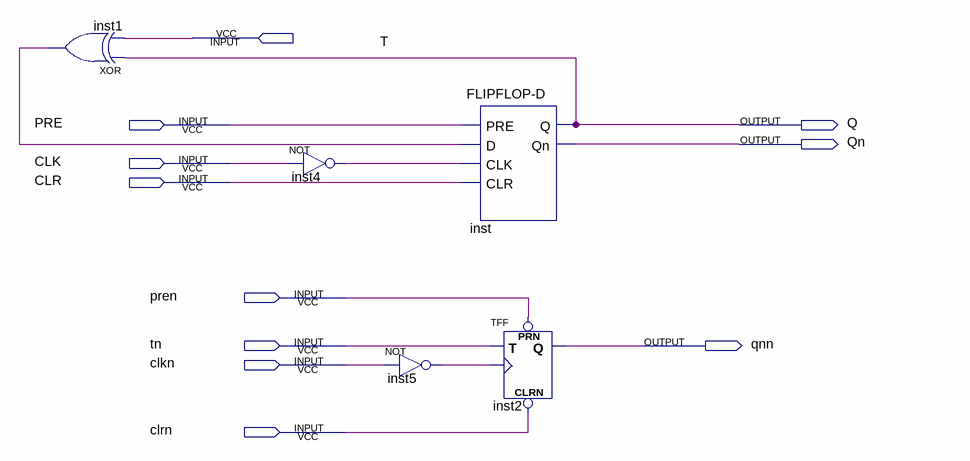
[diagram p0: schematic sheet]
// Quartus schematic FLIPFLOP-T.bdf as structural Verilog: 5 symbols, 11 pins
module \FLIPFLOP-T  (
  input  T,
  input  PRE,
  input  CLK,
  input  CLR,
  input  pren,
  input  tn,
  input  clkn,
  input  clrn,
  output Q,
  output Qn,
  output qnn
);

  wire inst1_out, inst4_out, inst5_out;

  xor inst1 (inst1_out, Q, T);
  not inst4 (inst4_out, CLK);
  not inst5 (inst5_out, clkn);
  \FLIPFLOP-D  inst (.PRE(PRE), .D(inst1_out), .CLK(inst4_out), .CLR(CLR), .Q(Q), .Qn(Qn));
  TFF inst2 (.PRN(pren), .CLRN(clrn), .T(tn), .CLK(inst5_out), .Q(qnn));
endmodule
